# Altium project ThrowBot_RX_LED_Board.PrjPcb
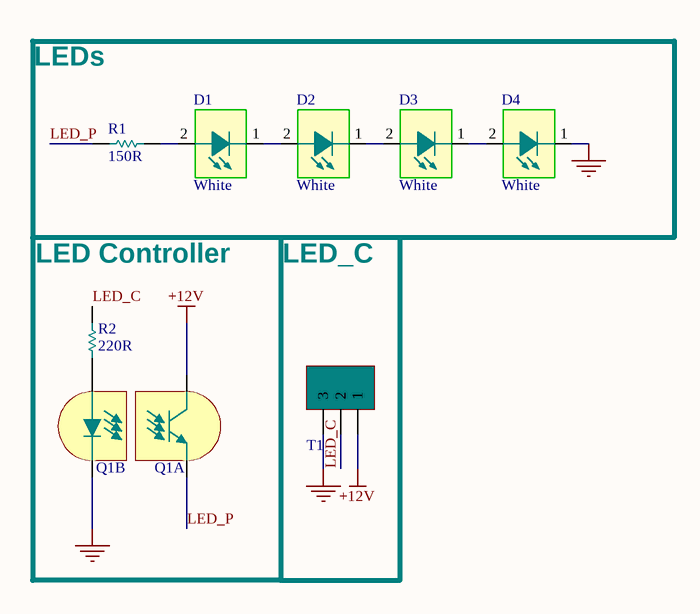
[diagram p0: ThrowBot_RX_LED_Board.SchDoc]
1 sheet, 8 parts. Net scope: global (net labels, ports and power ports of the same name join across sheets).
Board file: ThrowBot_RX_LED_Board.PcbDoc

## Sheet ThrowBot_RX_LED_Board.SchDoc
size A; SheetNumber: 1; SheetTotal: 1

### Parts
D1  Color-4: White  [LED 3528]  (hidden comment: LED)
D2  Color-4: White  [LED 3528]  (hidden comment: LED)
D3  Color-4: White  [LED 3528]  (hidden comment: LED)
D4  Color-4: White  [LED 3528]  (hidden comment: LED)
Q1  PC817  [PC817]  (value not drawn)  (parts A,B of 2)
R1  Val-8: 150R  [RES 1206]  (hidden comment: Resistor)
R2  Val-3: 220R  [RES 1206]  (hidden comment: Resistor)
T1  3 Pin Socket  [XH-3AW]  (value not drawn)

### Nets
+12V: Q1.4(C) T1.1
GND: D4.1 Q1.2(K) T1.3
LED_C: R2.2 T1.2
LED_P: Q1.3(E) R1.2
NetD1_1: D1.1 D2.2
NetD1_2: D1.2 R1.1
NetD2_1: D2.1 D3.2
NetD3_1: D3.1 D4.2
NetQ1_1: Q1.1(A) R2.1

### Notes on the sheet
- LEDs
- (near R2) LED Controller
- LED_C

### Library data of the parts
D1-D4 = LED: Color-1: Blue; Color-2: Red; Color-3: Green
Q1 = PC817: DIP 4pin General Purpose  Photocoupler
R1 = Resistor: Val-1: 1K; Val-2: 10K; Val-3: 220R; Val-4: 100K; Val-5: 24.9K; Val-6: 8.2K; Val-7: 43K
R2 = Resistor: Val-1: 1K; Val-2: 10K